# EAGLE design LedTaster_4TE_3.54 (EAGLE 7.4.0)
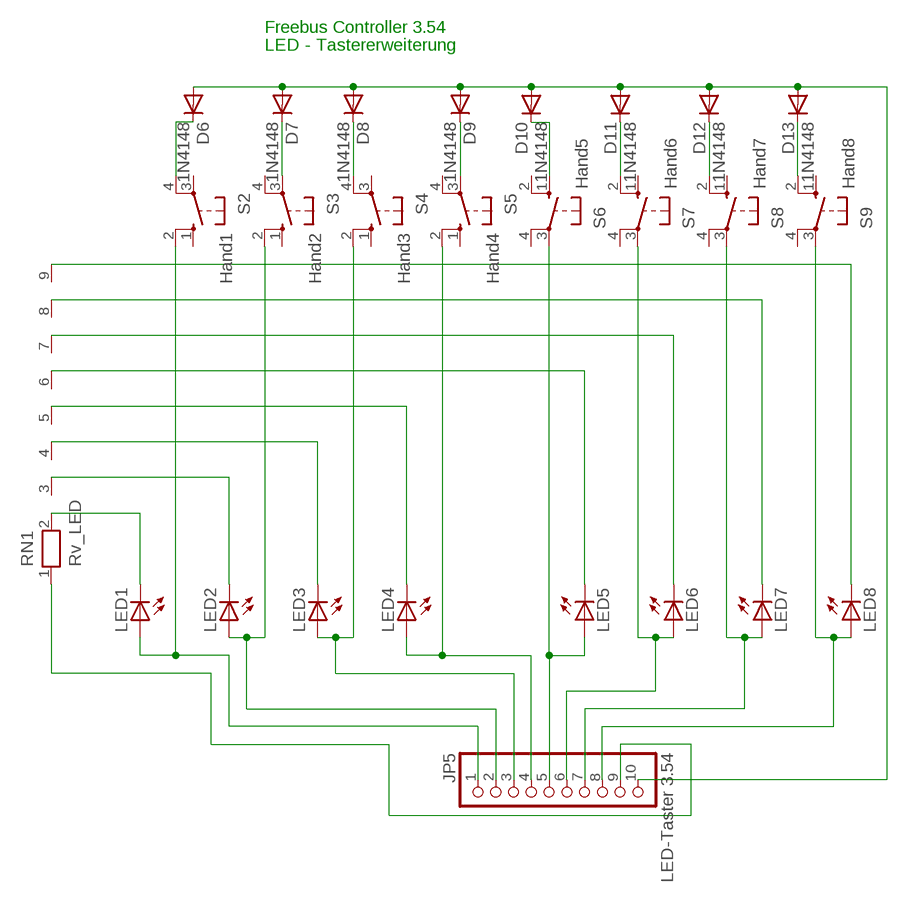
[diagram p0: schematic, sheet 1]

## Parts
D6  1N4148  [DO35-10]
D7  1N4148  [DO35-10]
D8  1N4148  [DO35-10]
D9  1N4148  [DO35-10]
D10  1N4148  [DO35-10]
D11  1N4148  [DO35-10]
D12  1N4148  [DO35-10]
D13  1N4148  [DO35-10]
JP5  LED-Taster 3.54  PINHD-1X10  [1X10]
LED1  LED3MM  [LED3MM]
LED2  LED3MM  [LED3MM]
LED3  LED3MM  [LED3MM]
LED4  LED3MM  [LED3MM]
LED5  LED3MM  [LED3MM]
LED6  LED3MM  [LED3MM]
LED7  LED3MM  [LED3MM]
LED8  LED3MM  [LED3MM]
RN1  Rv_LED  RN08  [RN-9]
S2  Hand1  10-XX  [B3F-10XX]
S3  Hand2  10-XX  [B3F-10XX]
S4  Hand3  10-XX  [B3F-10XX]
S5  Hand4  10-XX  [B3F-10XX]
S6  Hand5  10-XX  [B3F-10XX]
S7  Hand6  10-XX  [B3F-10XX]
S8  Hand7  10-XX  [B3F-10XX]
S9  Hand8  10-XX  [B3F-10XX]

## Nets
GND: JP5.9 RN1.1
N$1: D6.C S2.4(P1)
N$2: JP5.1 LED1.A S2.2(S1)
N$3: JP5.7 LED7.A S8.3(P)
N$4: D10.C S6.1(S)
N$5: D13.C S9.2(S1)
N$6: D8.C S4.4(P1)
N$7: D9.C S5.3(P)
N$9: D11.C S7.2(S1)
N$10: D12.C S8.2(S1)
N$11: D7.C S3.3(P)
N$12: JP5.5 LED5.A S6.3(P)
N$14: JP5.3 LED3.A S4.2(S1)
N$15: JP5.2 LED2.A S3.2(S1)
N$18: JP5.6 LED6.A S7.3(P)
N$20: JP5.4 LED4.A S5.2(S1)
N$23: JP5.8 LED8.A S9.3(P)
N$26: LED8.K(C) RN1.9
N$36: LED1.K(C) RN1.2
N$37: LED2.K(C) RN1.3
N$39: LED3.K(C) RN1.4
N$40: LED4.K(C) RN1.5
N$41: LED5.K(C) RN1.6
N$42: LED6.K(C) RN1.7
N$44: LED7.K(C) RN1.8
T_MUX: D6.A D7.A D8.A D9.A D10.A D11.A D12.A D13.A JP5.10
Unconnected: S2.1(S) S2.3(P) S3.1(S) S3.4(P1) S4.1(S) S4.3(P) S5.1(S) S5.4(P1) S6.2(S1) S6.4(P1) S7.1(S) S7.4(P1) S8.1(S) S8.4(P1) S9.1(S) S9.4(P1)

## Notes on the sheet
- Freebus Controller 3.54
- LED - Tastererweiterung

## Library data of the parts
D6-D13 = diode:1N4148: DIODE high speed (Philips)
JP5 = pinhead:PINHD-1X10: PIN HEADER
LED1-LED8 = led:LED: LED OSRAM: - CHIPLED LG R971, LG N971, LY N971, LG Q971, LY Q971, LO R971, LY R971 LH N974, LH R974 LS Q976, LO Q976, LY Q976 LO Q996 - Hyper CHIPLED LW Q18S LB Q993, LB Q99A, LB R99A - SideLED LS A670, LO A670, LY A670, LG A670, LP A670 LB A673, LV A673, LT A673, LW A673 LH A674 LY A675 LS A676, LA A676, LO A676, LY A676, LW A676 LS A679, LY A679, LG A679 - Hyper Micro SIDELED® LS Y876, LA Y876, LO Y876, LY Y876 LT Y87S - SmartLED LW L88C, LW L88S LB L89C, LB L89S, LG L890 LS L89K, LO L89K, LY L89K LS L896, LA L896, LO L896, LY L896 - TOPLED LS T670, LO T670, LY T670, LG T670, LP T670 LSG T670, LSP T670, LSY T670, LOP T670, LYG T670 LG T671, LOG T671, LSG T671 LB T673, LV T673, LT T673, LW T673 LH T674 LS T676, LA T676, LO T676, LY T676, LB T676, LH T676, LSB T676, LW T676 LB T67C, LV T67C, LT T67C, LS T67K, LO T67K, LY T67K, LW E67C LS E67B, LA E67B, LO E67B, LY E67B, LB E67C, LV E67C, LT E67C LW T67C LS T679, LY T679, LG T679 LS T770, LO T770, LY T770, LG T770, LP T770 LB T773, LV T773, LT T773, LW T773 LH T774 LS E675, LA E675, LY E675, LS T675 LS T776, LA T776, LO T776, LY T776, LB T776 LHGB T686 LT T68C, LB T68C - Hyper Mini TOPLED® LB M676 - Mini TOPLED Santana® LG M470 LS M47K, LO M47K, LY M47K Source: http://www.osram.convergy.de - LUMILED® LXK2-PW12-R00, LXK2-PW12-S00, LXK2-PW14-U00, LXK2-PW14-V00 LXK2-PM12-R00, LXK2-PM12-S00, LXK2-PM14-U00 LXK2-PE12-Q00, LXK2-PE12-R00, LXK2-PE12-S00, LXK2-PE14-T00, LXK2-PE14-U00 LXK2-PB12-K00, LXK2-PB12-L00, LXK2-PB12-M00, LXK2-PB14-N00, LXK2-PB14-P00, LXK2-PB14-Q00 LXK2-PR12-L00, LXK2-PR12-M00, LXK2-PR14-Q00, LXK2-PR14-R00 LXK2-PD12-Q00, LXK2-PD12-R00, LXK2-PD12-S00 LXK2-PH12-R00, LXK2-PH12-S00 LXK2-PL12-P00, LXK2-PL12-Q00, LXK2-PL12-R00 Source: www.luxeon.com
RN1 = resistor-net:RN08: RESISTOR NETWORK
S2-S9 = switch-omron:10-XX: OMRON SWITCH

## Board
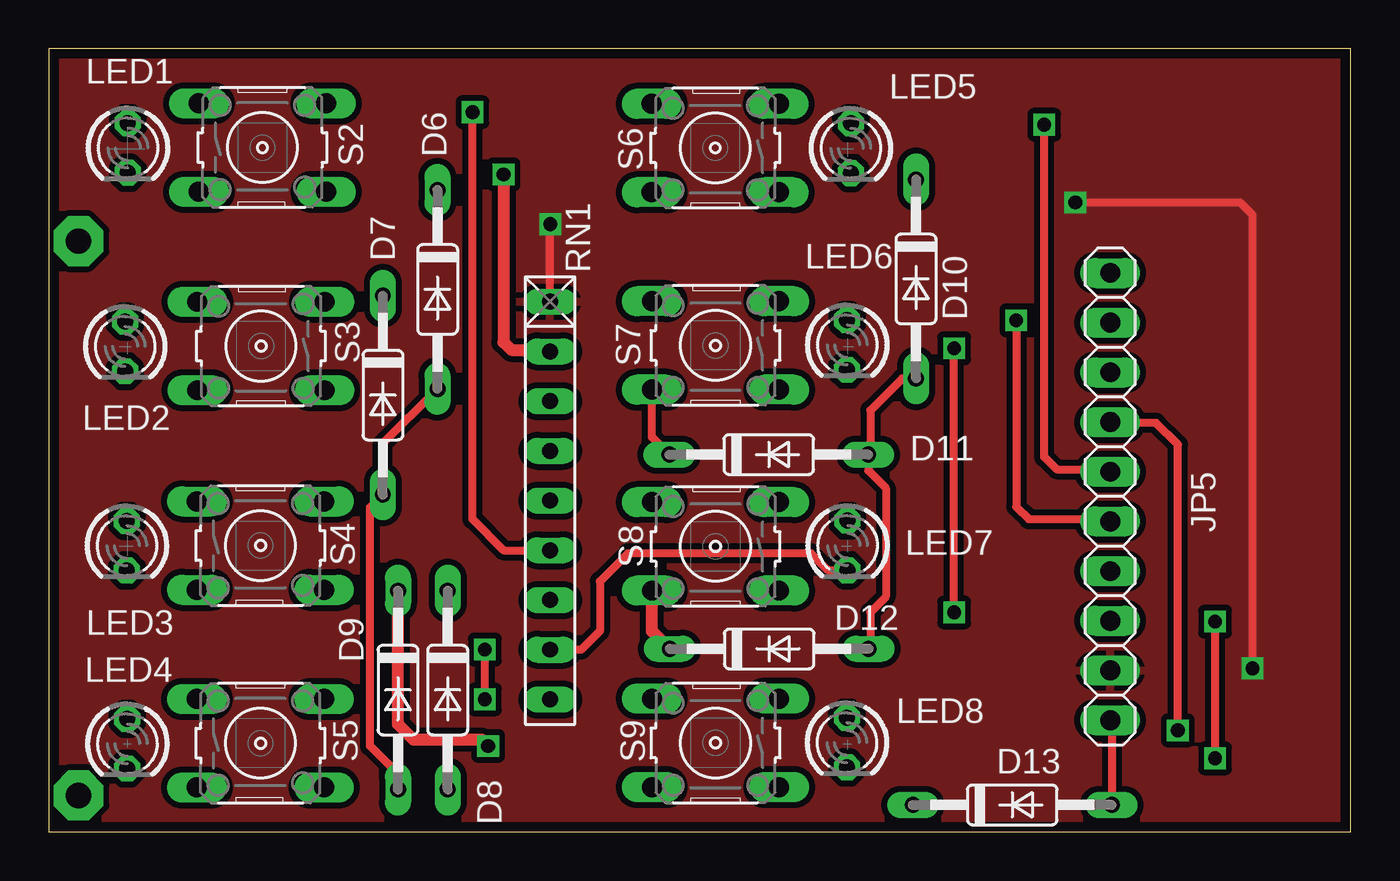
[diagram p1: board, top side]
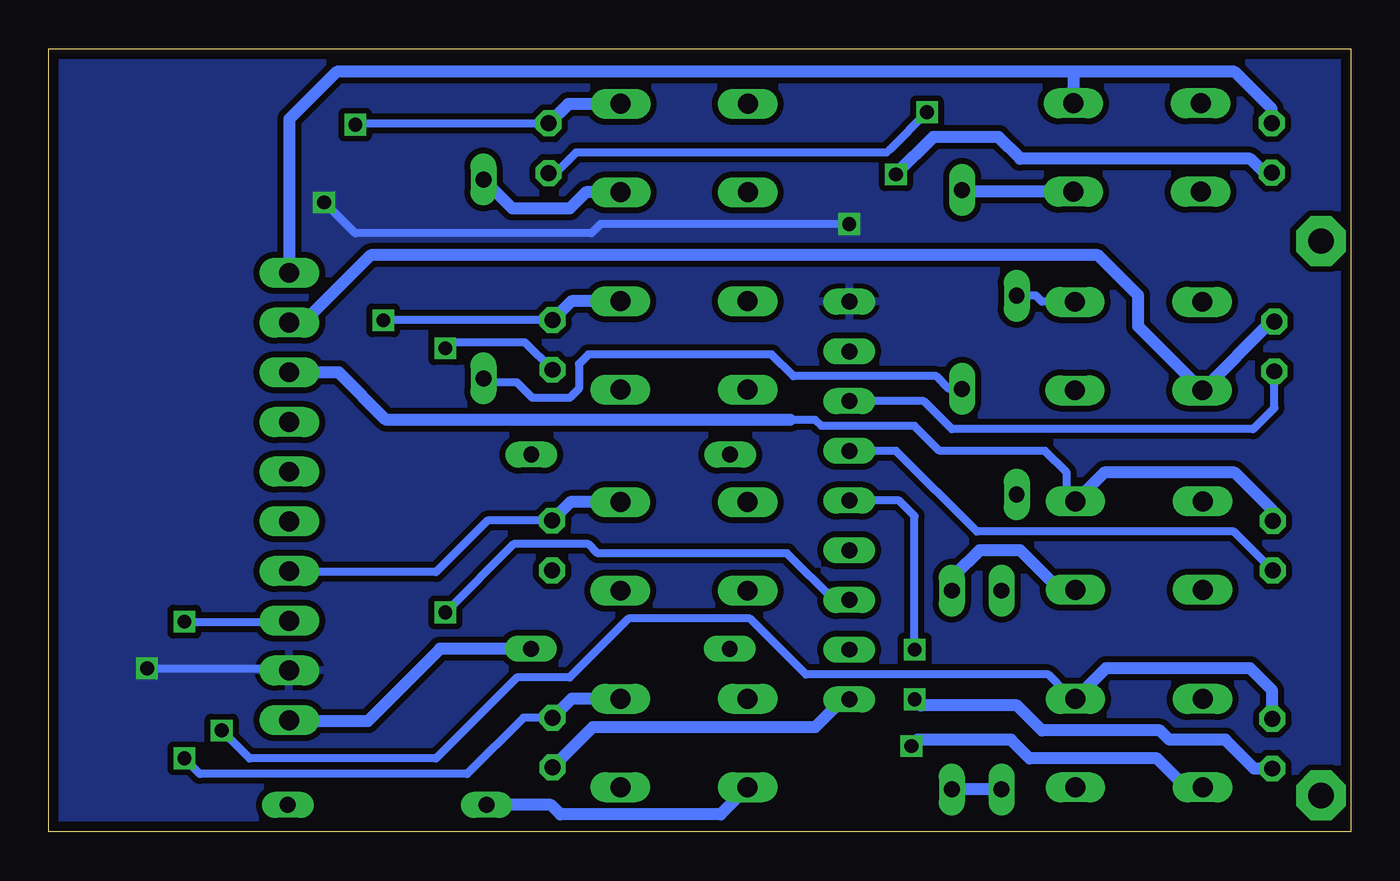
[diagram p2: board, bottom side, seen from below]

Size 66.5 x 40 mm. Coordinates in mm from the lower left corner, seen from the top.
Outline: 0,0 66.5,0 66.5,40 0,40 0,0
Copper layers (1*16): Top 0.035mm / dielectric 1.5mm / Bottom 0.035mm
Design rules "default *": minimum track width 10mil, minimum drill 24mil, track to track 12mil, track to pad 12mil, pad to pad 12mil, via to via 12mil, smd to smd 8mil, copper to edge 20mil, drill to drill 8mil, minimum pad ring 10mil, minimum via ring 8mil, stop-mask expansion 4mil, vias tented up to drill 0mil, thermal gap 10mil

### Footprints (pad centres in the part's own frame; a part is rotated, then mirrored left to right if it is on the bottom)
DO35-10 = drill 0.813 long: A 5.08,0; C -5.08,0
1X10 = drill 1.016 long: 1 -11.43,0; 2 -8.89,0; 3 -6.35,0; 4 -3.81,0; 5 -1.27,0; 6 1.27,0; 7 3.81,0; 8 6.35,0; 9 8.89,0; 10 11.43,0
LED3MM = drill 0.813 octagon: A -1.27,0; K 1.27,0
RN-9 = drill 0.813 long: 1 -10.16,0; 2 -7.62,0; 3 -5.08,0; 4 -2.54,0; 5 0,0; 6 2.54,0; 7 5.08,0; 8 7.62,0; 9 10.16,0
B3F-10XX = drill 1.016 long: 1 -3.251,2.261; 2 3.251,2.261; 3 -3.251,-2.261; 4 3.251,-2.261

### Placement (x,y rotation side)
D6  19.85,27.71 270 top
D7  17.06,22.31 270 top
D8  20.37,7.24 270 top
D9  17.83,7.24 270 top
D10  44.3,28.24 270 top
D11  36.78,19.27 0 top
D12  36.8,9.34 0 top
D13  49.22,1.37 0 top
JP5  54.22,17.12 270 top
LED1  4.03,34.94 270 top
LED2  3.89,24.8 270 top
LED3  3.98,14.61 270 top
LED4  4,4.5 270 top
LED5  40.97,34.93 270 top
LED6  40.78,24.87 270 top
LED7  40.8,14.62 270 top
LED8  40.77,4.55 270 top
RN1  25.61,16.92 270 top
S2  10.91,34.96 0 top
S3  10.83,24.82 180 top
S4  10.81,14.62 0 top
S5  10.81,4.52 0 top
S6  34.04,34.94 180 top
S7  34.05,24.85 180 top
S8  34.05,14.58 180 top
S9  34.05,4.54 180 top

### Tracks (layer width: path | path; a pad name or v marks a point on that pad's centre or on a via)
GND  (via drill 0.7)
  Top 0.406: RN1.1 v25.61,31.05 | v52.44,32.16 60.85,32.16 61.48,31.53 v61.48,8.35
  Bottom 0.406: v25.61,31.05 38.31,31.05 38.78,30.57 50.85,30.57 v52.44,32.16 | v61.48,8.35 54.34,8.35 JP5.9
  pour Bottom: -0.27,40.26 66.56,40.26 66.88,39.94 66.88,-0.22 66.72,-0.38 -0.43,-0.38
  pour Top: -0.43,40.26 -0.43,-0.38 66.72,-0.38 66.72,40.26 -0.11,40.26
N$1
  Bottom 0.61: S2.4 19.94,32.7 D6.C
N$2
  Bottom 0.61: LED1.A 4.03,36.94 5.92,38.83 14.34,38.83 | JP5.1 54.22,36.41 51.8,38.83 14.34,38.83 | S2.2 14.16,38.65 14.34,38.83
N$3
  Bottom 0.406: LED7.A 44.1,15.89 46.72,13.27 54.18,13.27 JP5.7
  Bottom 0.61: S8.3 39.85,16.84 LED7.A
N$4
  Bottom 0.61: S6.1 39.06,32.68 39.9,31.85 42.82,31.85 D10.C
N$5
  Bottom 0.61: D13.C 40.85,1.37 40.37,0.89 32.19,0.89 S9.2
N$6
  Bottom 0.406: 20.21,13.11 20.21,12.48 D8.C
  Bottom 0.61: S4.4 14.85,12.36 16.88,14.38 18.94,14.38 20.21,13.11
N$7  (via drill 0.7)
  Top 0.61: v22.43,4.38 22.11,4.7 18.62,4.7 17.83,5.49 D9.C
  Bottom 0.61: S5.3 8.41,2.26 9.89,3.75 16.4,3.75 17.35,4.7 22.11,4.7 v22.43,4.38
N$9
  Top 0.406: S7.2 30.8,20.17 D11.C
N$10
  Top 0.61: S8.2 30.8,10.26 D12.C
N$11
  Bottom 0.406: S3.3 15.77,27.08 16.08,27.4 D7.C
N$12  (via drill 0.7)
  Top 0.406: v50.85,36.13 50.85,19.14 51.48,18.51 54.1,18.51 JP5.5
  Bottom 0.406: LED5.A 50.78,36.2 v50.85,36.13
  Bottom 0.61: S6.3 39.96,37.2 LED5.A
N$14
  Bottom 0.406: 28.62,21.05 27.35,21.05 27.04,20.73 22.27,20.73 21,19.46 15.61,19.46 14.5,18.35 14.5,17.32 S4.2
  Bottom 0.61: LED3.A 3.98,16.41 5.92,18.35 12.59,18.35 S4.2 | JP5.3 51.69,23.47 49.26,21.05 28.62,21.05
N$15
  Bottom 0.61: LED2.A 4.07,26.07 S3.2 10.84,25.82 10.84,27.4 12.91,29.46 50.05,29.46 53.5,26.02 JP5.2
N$18  (via drill 0.7)
  Top 0.406: v49.42,26.13 49.42,16.61 50.05,15.97 54.1,15.97 JP5.6
  Bottom 0.406: LED6.A 49.41,26.14 v49.42,26.13
  Bottom 0.61: S7.3 39.81,27.11 LED6.A
N$20  (via drill 0.7)
  Top 0.406: v57.67,5.18 57.67,19.78 56.56,20.89 54.26,20.89 JP5.4
  Bottom 0.406: S5.2 14.36,7.08 14.5,7.08 15.45,8.03 27.83,8.03 30.69,10.89 36.88,10.89 39.9,7.87 42.59,7.87 46.72,3.75 56.25,3.75 v57.67,5.18 | 55.29,20.89 54.26,20.89 JP5.4
  Bottom 0.61: LED4.A 4,7.22 5.13,8.35 12.49,8.35 S5.2 14.08,6.76
N$23  (via drill 0.7)
  Top 0.406: v59.58,3.75 v59.58,10.73
  Bottom 0.406: LED8.A 42.26,5.82 45.13,2.95 58.79,2.95 v59.58,3.75 | v59.58,10.73 54.26,10.73 JP5.8
  Bottom 0.61: S9.3 39.79,6.8 LED8.A
N$26
  Bottom 0.61: RN1.9 25.92,6.76 27.35,5.33 38.72,5.33 LED8.K
N$27  (via drill 1.3 pad 2.54)
  other vias: 1.51,30.18
N$28  (via drill 1.3 pad 2.54)
  other vias: 1.51,1.86
N$36  (via drill 0.7)
  Top 0.61: v23.23,33.59 23.23,25.02 23.62,24.62 25.53,24.62 RN1.2
  Bottom 0.61: LED1.K 4.42,33.67 5.13,34.39 16.88,34.39 17.99,35.5 21.32,35.5 v23.23,33.59
N$37
  Bottom 0.406: LED2.K 3.89,21.65 4.97,20.57 20.37,20.57 21.8,22 RN1.3
N$39
  Bottom 0.406: RN1.4 23.23,19.46 19.1,15.34 5.97,15.34 LED3.K
N$40  (via drill 0.7)
  Top 0.406: v22.27,6.76 v22.27,9.3
  Bottom 0.406: v22.27,9.3 22.27,16.13 23.07,16.92 RN1.5
  Bottom 0.61: LED4.K 4.93,3.23 6.4,4.7 9.26,4.7 9.73,5.18 15.77,5.18 17.04,6.45 21.96,6.45 v22.27,6.76
N$41  (via drill 0.7)
  Top 0.406: v21.64,36.77 21.64,15.97 23.23,14.38 RN1.6
  Bottom 0.406: LED5.K 40.62,33.66 39.58,34.7 23.7,34.7 23.54,34.86 v21.64,36.77
N$42  (via drill 0.7)
  Top 0.406: v46.24,11.21 v46.24,24.7
  Bottom 0.406: RN1.7 26.4,11.84 28.78,14.22 38.47,14.22 38.94,14.7 42.75,14.7 v46.24,11.21 | v46.24,24.7 46.09,24.7 45.77,25.02 42.19,25.02 LED6.K
N$44
  Top 0.406: LED7.K 39.81,13.36 38.94,14.22 29.58,14.22 28.15,12.8 28.15,10.25 27.2,9.3 RN1.8 | RN1.8
T_MUX
  Top 0.406: D6.A 17.06,19.84 D7.A 16.4,16.57 16.4,4.38 17.83,2.95 D9.A | D13.A 54.3,5.62 JP5.10 | D10.A 43.6,23.16 41.96,21.53 41.96,19.38 D11.A 41.86,18.45 42.75,17.56 42.75,12 41.96,11.21 41.96,9.43 D12.A
  Bottom 0.406: D6.A 20.52,22.63 21.16,23.27 28.47,23.27 29.58,24.38 38.94,24.38 39.42,23.91 39.42,22.64 39.9,22.16 41.8,22.16 42.59,22.96 44.09,22.96 D10.A
  Bottom 0.61: 54.3,5.7 JP5.10 54.18,5.65 50.21,5.65 46.52,9.34 D12.A | D9.A D8.A